# EAGLE board ControllerV6 (EAGLE 9.6.2)
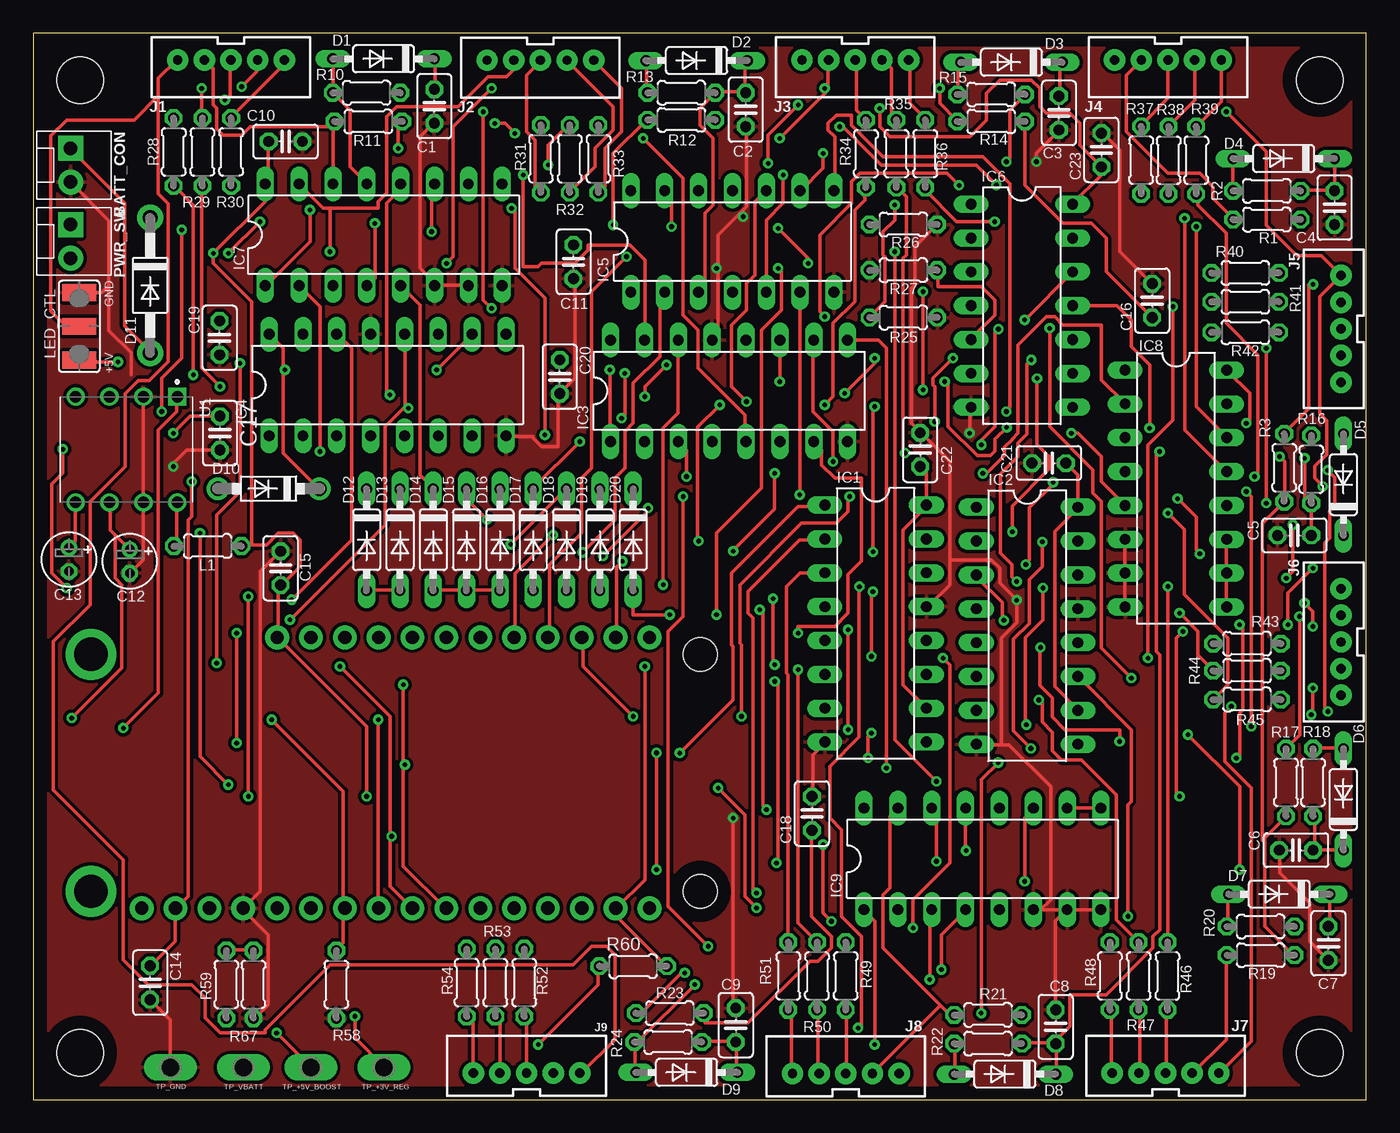
[diagram p5: board, top side]
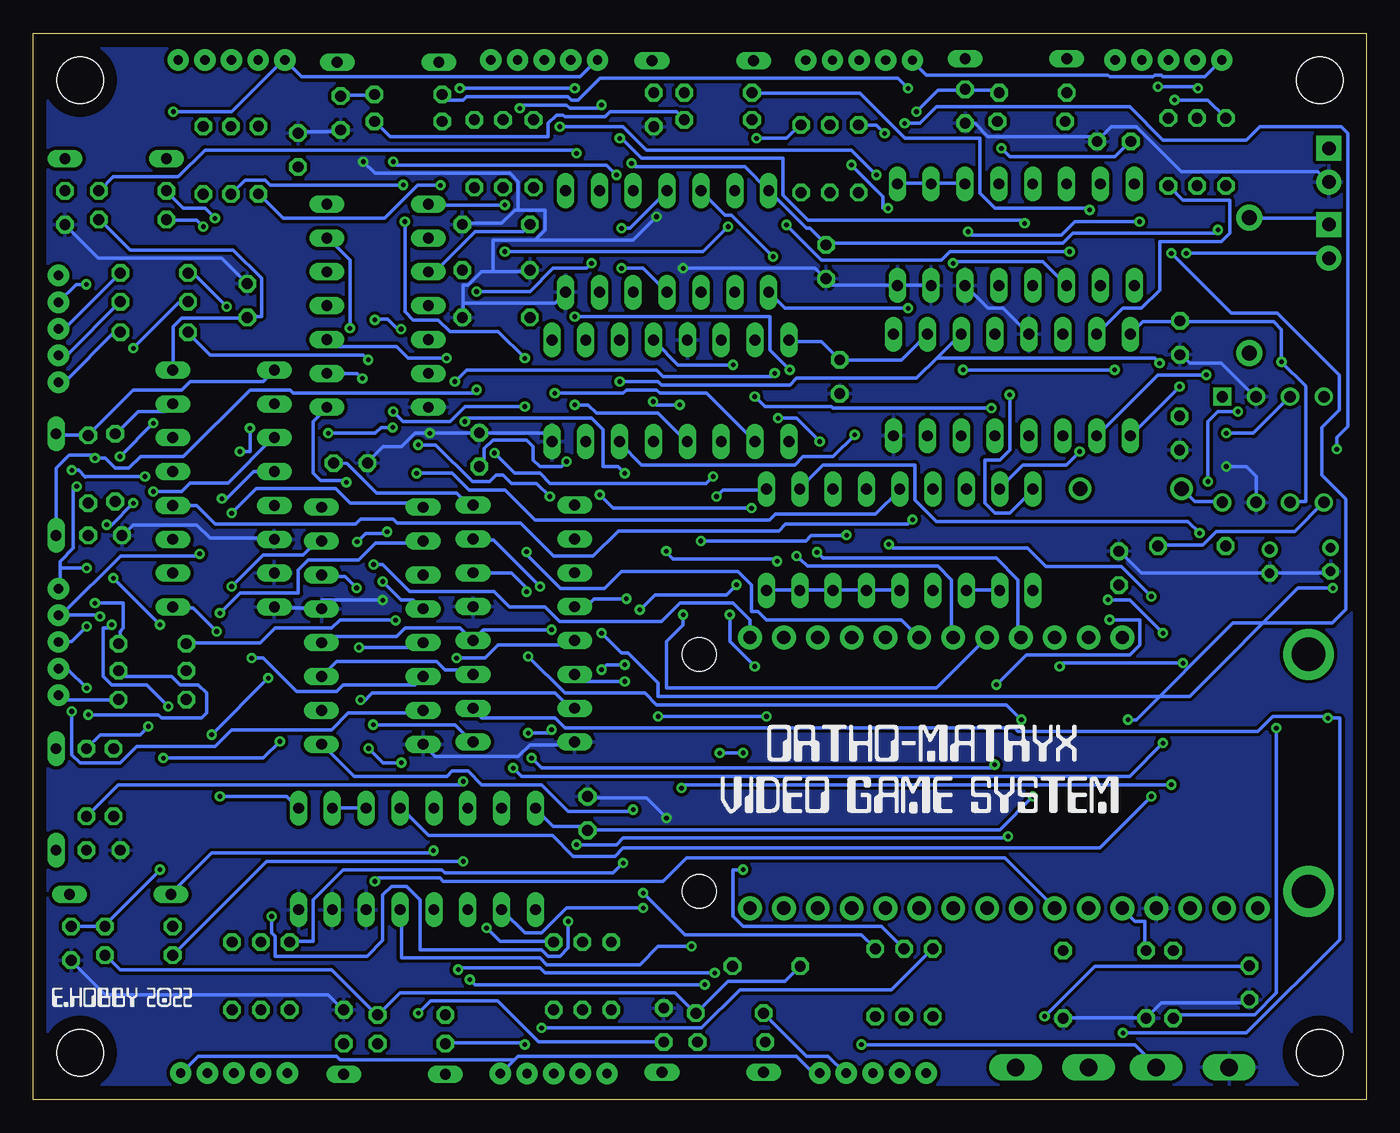
[diagram p6: board, bottom side, seen from below]

Size 100 x 80 mm. Coordinates in mm from the lower left corner, seen from the top.
Outline: 0,0 100,0 100,80 0,80 0,0
Copper layers (1*16): Top 0.035mm / dielectric 1.5mm / Bottom 0.035mm
Design rules "default *": minimum track width 10mil, minimum drill 0.35mm, track to track 10mil, track to pad 10mil, pad to pad 10mil, via to via 10mil, smd to smd 6mil, copper to edge 40mil, drill to drill 6mil, minimum pad ring 10mil, minimum via ring 8mil, stop-mask expansion 4mil, vias tented up to drill 0mil, thermal gap 10mil
Holes 3.5 mm at 3.5,76.5 3.5,3.5 96.5,3.5 96.5,76.5

## Footprints (pad centres in the part's own frame; a part is rotated, then mirrored left to right if it is on the bottom)
MOLEX-1X2 = drill 1.016 pad 1.88 square: 1 0,0 | drill 1.016 pad 1.88: 2 2.54,0
C025-025X050 = drill 0.813 octagon: 1 -1.27,0; 2 1.27,0
E1,8-4 = drill 0.711 pad 1.168: + -0.889,0 | drill 0.711 pad 1.168 octagon: - 0.889,0
DO35-7 = drill 0.813 long: A 3.81,0; C -3.81,0
DO41-7.6 = drill 1.1 pad 1.7: A 3.81,0; C -3.81,0
DO41-10 = drill 1.118 pad 1.93: A 5.08,0; C -5.08,0
DIL16 = drill 0.813 long: 1 -8.89,-3.81; 2 -6.35,-3.81; 3 -3.81,-3.81; 4 -1.27,-3.81; 5 1.27,-3.81; 6 3.81,-3.81; 7 6.35,-3.81; 8 8.89,-3.81; 9 8.89,3.81; 10 6.35,3.81; 11 3.81,3.81; 12 1.27,3.81; 13 -1.27,3.81; 14 -3.81,3.81; 15 -6.35,3.81; 16 -8.89,3.81
DIL14 = drill 0.813 long: 1 -7.62,-3.81; 2 -5.08,-3.81; 3 -2.54,-3.81; 4 0,-3.81; 5 2.54,-3.81; 6 5.08,-3.81; 7 7.62,-3.81; 8 7.62,3.81; 9 5.08,3.81; 10 2.54,3.81; 11 0,3.81; 12 -2.54,3.81; 13 -5.08,3.81; 14 -7.62,3.81
JST-5-PTH-VERT = drill 0.7 pad 1.6: 1 -4,0.18; 2 -2,0.18; 3 0,0.18; 4 2,0.18; 5 4,0.18
0204/5 = drill 0.813 octagon: 1 -2.54,0; 2 2.54,0
SJ_2W = smd 1.27 x 2.54: 1 -2.54,0; 2 0,0; 3 2.54,0
FEATHERWING = drill 1 pad 1.778: 1 6.35,1.27; 2 8.89,1.27; 3 11.43,1.27; 4 13.97,1.27; 5 16.51,1.27; 6 19.05,1.27; 7 21.59,1.27; 8 24.13,1.27; 9 26.67,1.27; 10 29.21,1.27; 11 31.75,1.27; 12 34.29,1.27; 13 36.83,1.27; 14 39.37,1.27; 15 41.91,1.27; 16 44.45,1.27; 17 44.45,21.59; 18 41.91,21.59; 19 39.37,21.59; 20 36.83,21.59; 21 34.29,21.59; 22 31.75,21.59; 23 29.21,21.59; 24 26.67,21.59; 25 24.13,21.59; 26 21.59,21.59; 27 19.05,21.59; 28 16.51,21.59 | drill 2.5 pad 3.81: P$1 2.54,20.32; P$2 2.54,2.54 | hole 2.54: 48.26,20.32; 48.26,2.54
P1-13Y = drill 1.321 pad 1.905 long: TP 0,0
DIP794W47P254L991H457Q8 = drill 0.86 pad 1.21 square: 1 -3.97,3.81 | drill 0.86 pad 1.21: 2 -3.97,1.27; 3 -3.97,-1.27; 4 -3.97,-3.81; 5 3.97,-3.81; 6 3.97,-1.27; 7 3.97,1.27; 8 3.97,3.81

## Placement (x,y rotation side)
BATT_CON  [MOLEX-1X2]  2.79,71.37 270 top
C1  1uF  [C025-025X050]  30.08,74.53 270 top
C2  1uF  [C025-025X050]  53.45,74.27 270 top
C3  1uF  [C025-025X050]  76.95,74.02 270 top
C4  1uF  [C025-025X050]  97.63,66.91 270 top
C5  1uF  [C025-025X050]  94.61,42.33 180 top
C6  1uF  [C025-025X050]  94.74,18.71 180 top
C7  1uF  [C025-025X050]  97.16,11.72 270 top
C8  1uF  [C025-025X050]  76.71,5.46 90 top
C9  1uF  [C025-025X050]  52.7,5.59 90 top
C10  0.1uF  [C025-025X050]  18.92,71.88 0 top
C11  0.1uF  [C025-025X050]  40.53,62.86 270 top
C12  100uF  [E1,8-4]  7.24,40.39 270 top
C13  150uF  [E1,8-4]  2.67,40.51 270 top
C14  0.1uF  [C025-025X050]  8.76,8.76 270 top
C15  0.1uF  [C025-025X050]  18.55,39.87 90 top
C16  0.1uF  [C025-025X050]  83.95,59.94 90 top
C17  0.1uF  [C025-025X050]  14,50 270 top
C18  0.1uF  [C025-025X050]  58.42,21.46 90 top
C19  0.1uF  [C025-025X050]  13.97,57.15 270 top
C20  0.1uF  [C025-025X050]  39.5,54.23 270 top
C21  0.1uF  [C025-025X050]  76.2,47.75 180 top
C22  0.1uF  [C025-025X050]  66.54,48.76 90 top
C23  0.1uF  [C025-025X050]  80.14,71.25 90 top
D1  1N4148  [DO35-7]  26.27,78.08 180 top
D2  1N4148  [DO35-7]  49.77,77.96 180 top
D3  1N4148  [DO35-7]  73.39,77.83 180 top
D4  1N4148  [DO35-7]  93.82,70.6 180 top
D5  1N4148  [DO35-7]  98.3,46.14 90 top
D6  1N4148  [DO35-7]  98.3,22.52 90 top
D7  1N4148  [DO35-7]  93.48,15.4 180 top
D8  1N4148  [DO35-7]  72.9,1.91 180 top
D9  1N4148  [DO35-7]  49.02,2.03 180 top
D10  1N5817  [DO41-7.6]  17.65,45.83 180 top
D11  1N4004  [DO41-10]  8.76,61.09 270 top
D12  1N4148  [DO35-7]  25,42 270 top
D13  1N4148  [DO35-7]  27.5,42 270 top
D14  1N4148  [DO35-7]  30,42 270 top
D15  1N4148  [DO35-7]  32.5,42 270 top
D16  1N4148  [DO35-7]  35,42 270 top
D17  1N4148  [DO35-7]  37.5,42 270 top
D18  1N4148  [DO35-7]  40,42 270 top
D19  1N4148  [DO35-7]  42.5,42 270 top
D20  1N4148  [DO35-7]  45,42 270 top
IC1  74HC595N  [DIL16]  63.2,35.71 270 top
IC2  74HC595N  [DIL16]  74.57,35.55 270 top
IC3  74HC595N  [DIL16]  52.2,53.18 0 top
IC4  74HC595N  [DIL16]  26.57,53.61 0 top
IC5  7414N  [DIL14]  52.45,64.38 0 top
IC6  7414N  [DIL14]  74.17,59.56 270 top
IC7  4053N  [DIL16]  26.29,64.89 0 top
IC8  4053N  [DIL16]  85.72,45.85 270 top
IC9  4053N  [DIL16]  71.22,18.06 0 top
J1  [JST-5-PTH-VERT]  14.83,78.19 180 top
J2  [JST-5-PTH-VERT]  38.04,78.17 180 top
J3  [JST-5-PTH-VERT]  61.67,78.19 180 top
J4  [JST-5-PTH-VERT]  85.13,78.19 180 top
J5  [JST-5-PTH-VERT]  98.3,57.83 90 top
J6  [JST-5-PTH-VERT]  98.3,34.33 90 top
J7  [JST-5-PTH-VERT]  84.95,1.8 0 top
J8  [JST-5-PTH-VERT]  60.96,1.78 0 top
J9  [JST-5-PTH-VERT]  37.01,1.8 0 top
L1  22uH  [0204/5]  13.08,41.53 180 top
LED_CTL  [SJ_2W]  3.45,58.01 90 top
MS2  FEATHERWING  [FEATHERWING]  1.78,13.08 0 top
PWR_SW  [MOLEX-1X2]  2.79,65.66 270 top
R1  10k  [0204/5]  92.55,66.03 180 top
R2  10k  [0204/5]  92.55,68.18 0 top
R3  10k  [0204/5]  93.85,47.41 270 top
R10  10k  [0204/5]  25,75.54 0 top
R11  10k  [0204/5]  25.13,73.38 180 top
R12  10k  [0204/5]  48.62,73.51 0 top
R13  10k  [0204/5]  48.62,75.54 180 top
R14  10k  [0204/5]  71.87,73.38 180 top
R15  10k  [0204/5]  71.87,75.42 0 top
R16  10k  [0204/5]  95.89,47.28 90 top
R17  10k  [0204/5]  93.98,23.79 90 top
R18  10k  [0204/5]  96.01,23.79 270 top
R19  10k  [0204/5]  92.08,10.83 180 top
R20  10k  [0204/5]  92.08,12.99 0 top
R21  10k  [0204/5]  71.63,6.35 0 top
R22  10k  [0204/5]  71.63,4.19 180 top
R23  10k  [0204/5]  47.75,6.48 180 top
R24  10k  [0204/5]  47.62,4.32 0 top
R25  10k  [0204/5]  65.28,58.67 0 top
R26  10k  [0204/5]  65.28,65.66 0 top
R27  10k  [0204/5]  65.28,62.23 180 top
R28  150  [0204/5]  10.53,71.1 270 top
R29  150  [0204/5]  12.68,71.1 270 top
R30  270  [0204/5]  14.84,71.1 270 top
R31  150  [0204/5]  38.08,70.59 270 top
R32  150  [0204/5]  40.24,70.59 270 top
R33  270  [0204/5]  42.4,70.59 270 top
R34  150  [0204/5]  62.47,70.97 270 top
R35  150  [0204/5]  64.75,70.97 270 top
R36  270  [0204/5]  66.91,70.97 270 top
R37  150  [0204/5]  83.12,70.49 270 top
R38  150  [0204/5]  85.18,70.48 270 top
R39  270  [0204/5]  87.25,70.48 270 top
R40  150  [0204/5]  90.93,62.02 180 top
R41  150  [0204/5]  90.93,59.86 180 top
R42  270  [0204/5]  90.93,57.57 180 top
R43  150  [0204/5]  91.06,34.2 180 top
R44  150  [0204/5]  91.06,32.17 180 top
R45  270  [0204/5]  91.06,30.01 180 top
R46  150  [0204/5]  85.09,9.27 90 top
R47  150  [0204/5]  82.93,9.27 90 top
R48  270  [0204/5]  80.77,9.27 90 top
R49  150  [0204/5]  60.96,9.27 90 top
R50  150  [0204/5]  58.8,9.27 90 top
R51  270  [0204/5]  56.64,9.27 90 top
R52  150  [0204/5]  36.83,8.76 90 top
R53  150  [0204/5]  34.67,8.76 90 top
R54  270  [0204/5]  32.51,8.76 90 top
R58  10k  [0204/5]  22.73,8.64 270 top
R59  10k  [0204/5]  14.48,8.64 270 top
R60  10k  [0204/5]  45,10 0 top
R67  10k  [0204/5]  16.51,8.64 270 top
TP_+3V_REG  PTR1PAD1-13Y  [P1-13Y]  26.29,2.41 90 top
TP_+5V_BOOST  PTR1PAD1-13Y  [P1-13Y]  20.83,2.41 90 top
TP_GND  PTR1PAD1-13Y  [P1-13Y]  10.29,2.41 90 top
TP_VBATT  PTR1PAD1-13Y  [P1-13Y]  15.75,2.41 90 top
U1  MAX756CPA  [DIP794W47P254L991H457Q8]  6.99,48.77 270 top

## Tracks (layer width: path | path; a pad name or v marks a point on that pad's centre or on a via)
+3V_REG  (via drill 0.35)
  Top 0.254: C14.1 8.88,10.12 10.62,11.88 10.62,14.25 MS2.2 10.75,14.38 11.62,15.25 11.62,43.5 11.88,43.75 v11.88,46.38 | v24.12,6.25 24.12,4.62 26.25,2.5 TP_+3V_REG.TP | IC6.14 78,67.25 80.12,69.38 80.12,69.88 C23.1 80.12,70 78.5,71.62 78.5,73.25 77.75,74 76,74 75.5,74.5 75.5,75.88 74.88,76.5 72.5,76.5 71.5,75.5 71.5,73.5 70.25,72.25 64.25,72.25 63.51,72.99 63.51,74.37 v63.5,74.38 | v57.38,74.62 55.12,72.38 v55.12,70.25 | v9.62,51.62 9.62,54.12 11.12,55.62 v11.12,65.25
  Bottom 0.254: v24.12,6.25 20.38,10 8.88,10 C14.1 | v63.5,74.38 63.25,74.62 60,74.62 59.75,74.38 57.62,74.38 v57.38,74.62 | v55.12,70.25 54.88,70 46.62,70 44.88,68.25 IC5.14 44.75,68.12 42,65.38 41.75,65.38 40.62,64.25 C11.1 40.5,64.25 22.75,64.25 22,65 11.38,65 v11.12,65.25 | v9.62,51.62 11.12,51.62 11.88,50.88 v11.88,46.38
+5V_BOOST  (via drill 0.35)
  Top 0.254: 18.75,54.75 18.75,56.38 17.75,57.38 IC4.16 | 18.75,54.75 18.75,48.5 21.38,45.88 D10.C | v30.25,54.75 32.88,57.38 IC4.10 | v18.88,54.75 18.75,54.75 | IC2.10 78.38,29.25 76.62,31 76.62,42.62 78.38,44.38 IC2.16 78.38,44.5 78.38,46.88 77.5,47.75 C21.1 | IC1.10 67,29.38 65.25,31.12 65.25,42.75 67,44.5 IC1.16 67,44.62 67,47 66.62,47.38 C22.1 | v60,47.88 60,50.12 58.5,51.62 58.5,56.88 IC3.10 | 6.19,42.31 5.75,42.75 5.75,44.75 U1.6 | 6.19,42.31 7.12,41.38 C12.+ | v18.25,5 20.75,2.5 TP_+5V_BOOST.TP | v2.88,28.62 6.62,32.38 6.62,38.62 6.12,39.12 6.12,42.25 6.19,42.31 | v6.35,55.35 3.58,55.35 LED_CTL.1
  Bottom 0.254: IC3.16 43.25,56.88 40.88,56.88 C20.1 39.38,55.5 34.88,55.5 33,57.38 IC4.10 | IC4.16 17.62,57.5 16.75,58.38 14,58.38 C19.1 13.88,58.38 6.94,58.38 6.35,57.79 v6.35,55.35 4.52,53.52 4.52,44.88 5.62,44.88 U1.6 | v18.88,54.75 v30.25,54.75 | C21.1 76.47,47.73 74.24,45.5 68.25,45.5 67.38,44.62 67.12,44.62 IC1.16 | v18.25,5 9,5 2,12 2,28.62 v2.88,28.62 2.88,28.75 7,28.75 8.12,27.62 26.12,27.62 26.38,27.88 60.12,27.88 60.88,28.62 66.38,28.62 67,29.25 IC1.10 | C22.1 66.16,47.87 66.16,48.83 65.5,49.49 63,49.49 62.5,48.99 62.5,48 62,47.5 60.38,47.5 v60,47.88
D1  (via drill 0.35)
  Top 0.254: D1.C 30.12,78 30.12,75.88 C1.1 | v34.38,59.38 33.75,60 v33.75,74.12
  Bottom 0.254: R10.2 27.75,75.75 30,75.75 C1.1 30.12,75.75 32.12,75.75 v33.75,74.12 | v34.38,59.38 43.62,59.38 44.75,60.5 IC5.1
D2
  Top 0.254: IC5.3 50,60.62 50.38,61 50.38,66.5 51,67.12 51,72.12 50,73.12 50,74.38 51.12,75.5 R13.1 51.25,75.62 53.38,75.62 C2.1 53.38,75.75 53.38,77.75 53.5,77.88 D2.C
D3  (via drill 0.35)
  Top 0.254: v56.25,69.38 56.25,67.25 55,66 55,60.62 IC5.5 | v73,70.38 73.25,70.62 73.25,74.25 74.38,75.38 R15.2 | D3.C 77.12,77.75 77,77.62 77,75.38 C3.1
  Bottom 0.254: v56.25,69.38 57,70.12 72.75,70.12 v73,70.38 | C3.1 76.88,75.38 74.5,75.38 R15.2
D4  (via drill 0.35)
  Top 0.254: D4.C 97.62,70.5 97.62,68.25 C4.1 97.5,68.25 95.12,68.25 R2.2 | v59.25,71 59.25,69.88 57.62,68.25 IC5.9
  Bottom 0.254: v59.25,71 59.5,71.25 87.12,71.25 89.12,69.25 94,69.25 95,68.25 R2.2
D5  (via drill 0.35)
  Top 0.254: C5.1 95.88,42.38 95.88,44.62 R16.1 95.38,45.05 v95.38,48.12 | v55.88,65.38 58.12,63.12 v58.12,62.75 | v66.75,53.25 v66.75,60.62
  Bottom 0.254: v55.88,65.38 55.25,65.38 52.5,68.12 IC5.11 | v58.12,62.75 58.5,62.38 61,62.38 62.75,60.62 v66.75,60.62 | v66.75,53.25 67,53 80.5,53 80.75,53.25 83.75,53.25 88.75,48.25 91.96,48.25 92.83,47.37 93.85,47.37 94.6,48.12 v95.38,48.12 95.62,48.38 97.29,48.38 98.3,47.37 D5.C
D6  (via drill 0.35)
  Top 0.254: D6.C 98.25,18.75 96.12,18.75 C6.1 96.12,18.88 96.12,21.12 R18.2 | v47.88,65.5 47.88,67.62 47.38,68.12 IC5.13 | v64.62,63.62 64.62,27 v67.75,23.88
  Bottom 0.254: v47.88,65.5 49.75,63.62 v64.62,63.62 | v67.75,23.88 68,23.62 93.62,23.62 R18.2
D7  (via drill 0.35)
  Top 0.254: D7.C 97.25,15.38 97.25,13 C7.1 | v76.25,57.88 76.25,50.5 79.5,47.25 79.5,45.5 80.12,44.88 80.12,33.88 v82.38,31.62 | v86.62,27.38 90.5,23.5 v90.5,17.25
  Bottom 0.254: C7.1 97.12,13 R20.2 94.62,13.12 v90.5,17.25 | v76.25,57.88 76.25,63 77.88,64.62 IC6.13 | v86.62,27.38 v82.38,31.62
D8  (via drill 0.35)
  Top 0.254: R22.1 74.25,4.25 76.62,4.25 C8.1 | D8.C 76.75,2 76.75,4.12 C8.1 | v83.75,50.38 83.75,55.12 82.38,56.5 82.38,58.5 81.31,59.56 IC6.11 | v84.5,48.62 84.25,48.38 84.25,33.62 84.5,33.38 84.5,12.75 84,12.25 84,11.38 80.5,7.88 77.75,7.88 77.75,5.5 76.62,4.38 C8.1
  Bottom 0.254: v83.75,50.38 83.75,48.62 v84.5,48.62
D9  (via drill 0.35)
  Top 0.254: R24.2 50.25,4.38 52.62,4.38 C9.1 52.75,4.25 52.75,2.12 D9.C | v75.31,54.1 75.31,49.15 76.2,48.26 76.2,47.29 73.45,44.55 v73.45,42.6 | v75.71,41.84 75.71,40.01 74.72,39.03 74.72,35.74 73.53,34.54 73.53,27.66 v74.84,26.35 | v72.39,25.27 71.12,24 v71.12,6.48
  Bottom 0.254: IC6.9 75.69,54.48 v75.31,54.1 | v75.71,41.84 75.07,42.48 73.57,42.48 v73.45,42.6 | v74.84,26.35 73.77,25.27 v72.39,25.27 | v71.12,6.48 70.21,7.39 65.18,7.39 62.1,4.32 C9.1
GND  (via drill 0.35)
  Top 0.254: IC4.8 35.5,49.75 37.5,49.75 37.5,49.62 38.12,49 39.38,49 39.38,52.88 C20.2 39.5,53 40.62,54.12 40.62,61.5 C11.2 | IC7.7 32.62,61.12 30.12,61.12 IC7.6 30.12,61.25 29,62.38 29,72.25 30,73.25 C1.2 | C14.2 8.88,7.38 10.25,6 10.25,2.5 TP_GND.TP | R67.2 16.62,6.12 17.62,7.12 17.62,12.38 15.75,14.25 MS2.4 15.75,14.38 17,15.62 17,39.62 18.5,41.12 C15.2 | 8.25,44.75 8.25,40.5 C12.- | 7.35,54.38 7.35,56.03 5.67,57.71 5.67,61.09 | 5.67,61.09 5.67,65.95 2.88,68.75 BATT_CON.2 | C7.2 97.12,10.5 95.75,11.88 95.75,14.75 93.5,17 93.5,18.62 C6.2 | C8.2 76.67,6.77 76.67,13.42 77.5,14.25 IC9.7 77.62,14.25 | 77.62,14.25 80,14.25 IC9.8 | v52.5,21.12 52.5,7 52.62,6.88 C9.2 | IC1.8 59.38,26.75 58.5,25.88 58.5,22.75 C18.2 | 72.59,26.62 70.88,26.62 IC2.8 | 72.59,26.62 73.21,26.62 76.33,23.51 76.33,15 75.57,14.25 IC9.6 77.62,14.25 | C16.2 83.88,61.25 81.5,63.62 81.5,71.25 80.25,72.5 C23.2 | IC8.8 81.88,37 81.88,39.38 IC8.7 81.88,39.5 81.88,42 IC8.6 | 51.38,62.38 51.38,64.88 53.06,66.56 | 51.38,62.38 51.38,57.38 51,57 IC3.13 | 53.06,66.56 53.5,67 53.5,73 C2.2 | 68.75,40.5 68.75,47.88 66.62,50 C22.2 66.5,50.12 65.88,50.75 65.88,60.88 66.12,61.12 66.12,64 67.75,65.62 R26.2 | 68.75,40.5 68.75,38.62 67.12,37 IC1.13 | v70.25,50 70.25,51.88 IC6.7 | 53.06,66.56 53.25,66.38 v53.25,66.25 | 68.75,40.5 71.88,40.5 72.5,39.88 72.5,38.75 v73.79,37.47 73.79,35.81 72.62,34.65 72.62,26.66 72.59,26.62 | v75.25,70.38 75.25,71 76.88,72.62 C3.2 | v51.25,62.38 51.38,62.38 | 5.67,61.09 5.14,60.55 LED_CTL.3 | 8.25,44.88 8.25,52.62 U1.2 | C17.2 11.5,48.73 10.5,47.73 v10.5,47.5
  Bottom 0.254: C1.2 30,73.25 29.38,73.25 28.38,72.25 20.5,72.25 20.25,72 C10.2 20.12,72 19.12,73 17.25,73 13.88,69.62 3.62,69.62 2.88,68.88 BATT_CON.2 | IC4.13 25.38,57.5 27.25,59.38 28.38,59.38 30,61 IC7.6 | IC7.7 32.75,61.12 35.12,61.12 IC7.8 35.25,61.12 40.12,61.12 40.5,61.5 C11.2 40.62,61.62 41.38,62.38 v51.25,62.38 | R58.2 22.62,6.12 16.62,6.12 R67.2 16.5,6.12 15.38,7.25 9,7.25 8.88,7.38 C14.2 | C13.- 2.75,39.5 7.12,39.5 C12.- 16.88,39.5 18.5,41.12 C15.2 | 8.38,52.75 10.88,55.25 13.25,55.25 13.88,55.88 C19.2 | C7.2 97.12,10.38 94.62,7.88 77.88,7.88 76.75,6.75 C8.2 | v52.5,21.12 54,22.62 58.38,22.62 C18.2 | IC2.8 70.75,26.62 69.88,25.75 63.62,25.75 62.75,26.62 59.62,26.62 59.5,26.75 IC1.8 | C3.2 77,72.62 80.12,72.62 C23.2 | C4.2 97.62,65.62 95.12,63.12 85.88,63.12 84,61.25 C16.2 | IC8.8 81.88,36.88 78.5,36.88 IC2.13 78.32,37.47 v73.79,37.47 | C5.2 93.25,42.38 92.5,43.12 87.75,43.12 86.75,42.12 82,42.12 IC8.6 | 67.75,59.75 67.75,61.12 67.38,61.12 66.38,62.12 65.5,62.12 | 67.75,59.75 67.75,58.75 R25.2 | 65.5,62.12 62.75,62.12 R27.2 | 67.75,59.75 60.88,59.75 60.12,60.5 IC5.7 | IC3.8 61.12,49.38 61.75,50 66.5,50 C22.2 66.62,50 v70.25,50 71.38,50 72.38,49 73.75,49 74.88,47.88 C21.2 | 65.5,62.12 65.5,64.5 62.38,64.5 | 62.38,64.5 61.62,65.25 61.62,66.75 63.62,66.75 | 63.62,66.75 63.88,66.75 64.88,65.75 67.75,65.75 R26.2 | v53.25,66.25 55,64.5 62.38,64.5 | v75.25,70.38 74.38,69.5 64.25,69.5 63.62,68.88 63.62,66.75 | U1.2 | v10.5,47.5 9,47.5 8.26,46.76 U1.7
  pour Top: 0,80 100,80 100,0 0,0 0,79.5
  pour Bottom: 0,80 100,80 100,0 0,0
INT_MCU  (via drill 0.35)
  Top 0.254: R60.2 47.5,10 43.75,13.75 43.75,14.25 MS2.15 43.75,14.38 45.88,16.5 v45.88,32.5 | D12.A 25,38.25 27.5,38.25 D13.A | D14.A 30,38.25 32.5,38.25 D15.A 32.62,38.25 35,38.25 D16.A | v47.75,36.38 45,36.38 D20.A
  Bottom 0.254: D16.A 35,38.25 37.5,38.25 D17.A 37.62,38.25 40,38.25 D18.A 40.12,38.25 42.5,38.25 D19.A 42.62,38.25 45,38.25 D20.A | D13.A 27.5,38.25 30,38.25 D14.A | v45.88,32.5 47.75,34.38 v47.75,36.38
LED1_B  (via drill 0.35)
  Top 0.254: v14.38,75 14.75,75.38 14.75,78 J1.3
  Bottom 0.254: v14.38,75 11.88,75 10.62,73.75 R28.1
LED1_G  (via drill 0.35)
  Top 0.254: v12.62,75.88 12.62,73.75 R29.1 | v15.62,76 16.75,77.12 16.75,78 J1.2
  Bottom 0.254: v12.62,75.88 12.75,76 v15.62,76
LED1_R
  Top 0.254: R30.1 14.88,73.75 18.75,77.62 18.75,78 J1.1
LED2_B
  Top 0.254: R31.2 38,68.12 37.62,68.5 37.62,72 37,72.62 37,76.88 38,77.88 J2.3
LED2_G
  Top 0.254: R32.2 40.25,68.12 42.12,70 42.12,71.38 43.5,72.75 43.5,74.5 40.12,77.88 J2.2
LED2_R
  Top 0.254: R33.2 42.5,68.12 42.88,68.5 42.88,71.38 44.12,72.62 44.12,75.88 42.12,77.88 J2.1
LED3_B
  Top 0.254: R34.1 62.38,73.62 61.75,74.25 61.75,78 J3.3
LED3_G
  Top 0.254: R35.1 64.75,73.62 64.38,74 64.38,77.38 63.75,78 J3.2
LED3_R
  Top 0.254: R36.1 66.88,73.62 65.75,74.75 65.75,78 J3.1
LED4_B
  Top 0.254: R37.1 83.12,73.12 85.12,75.12 J4.3
LED4_G
  Top 0.254: R38.1 85.25,73.12 87.12,75 J4.2
LED4_R
  Top 0.254: R39.1 87.38,73.12 89.12,74.88 J4.1
LED5_B
  Bottom 0.254: R40.1 97.66,57.83 J5.3
LED5_G
  Bottom 0.254: R41.1 97.5,55.83 J5.2
LED5_R
  Bottom 0.254: R42.1 93.93,57.57 97.62,53.88 98,53.88 J5.1
LED6_B  (via drill 0.35)
  Top 0.254: v95.38,37.25 96,36.62 v96,35.5
  Bottom 0.254: v95.38,37.25 93.25,37.25 93.25,35.38 93.5,35.12 93.5,34.25 R43.1 | v96,35.5 97.12,34.38 98,34.38 J6.3
LED6_G  (via drill 0.35)
  Top 0.254: v95.88,28.88 96,29 v96,30.88
  Bottom 0.254: v95.88,28.88 90.62,28.88 90.38,28.62 87.38,28.62 87,29 87,30.5 87.62,31.12 89,31.12 89.62,31.75 93.12,31.75 93.5,32.12 R44.1 | v96,30.88 97.38,32.25 98,32.25 J6.2
LED6_R
  Bottom 0.254: R45.1 93.62,30 97.75,30 98,30.25 J6.1
LED7_B
  Top 0.254: R46.1 85,6.62 85,2 J7.3
LED7_G
  Top 0.254: R47.1 83,6.62 83,2 J7.2
LED7_R
  Top 0.254: R48.1 80.88,6.62 80.88,2 J7.1
LED8_B
  Top 0.254: R49.1 61,6.62 61,2 J8.3
LED8_G
  Top 0.254: R50.1 58.88,6.62 58.88,2 J8.2
LED8_R
  Top 0.254: R51.1 56.75,6.62 56.88,6.5 56.88,2 J8.1
LED9_B
  Top 0.254: R52.1 36.88,6.12 37,6 37,2 J9.3
LED9_G
  Top 0.254: R53.1 34.75,6.12 35,5.88 35,2 J9.2
LED9_R
  Top 0.254: R54.1 32.62,6.12 33,5.75 33,2 J9.1
LED_CTL  (via drill 0.35)
  Top 0.254: 9.38,75.31 9.38,76.62 10.75,78 J1.5 | v96.75,46.01 96.14,46.61 96.14,47.52 97.03,48.4 97.03,50.93 96.5,51.45 96.5,60.25 98,61.75 J5.5 96.62,63.33 94.8,63.33 92.5,65.62 92.5,71.12 v89.5,74.12 | v89.88,29.5 89.38,29 89.38,25.38 91.38,23.38 91.38,4.38 89,2 J7.5 | v94.12,35.62 94.12,38 v96,39.88 | 9.38,75.31 9.38,67.96 10.12,67.21 10.12,55.38 8.7,53.95 7.87,53.95 6.88,52.95 6.88,47.5 4.25,44.88 4.25,37.12 1.5,34.38 1.5,23.25 6.75,18 6.75,10.5 8.62,8.62 11.88,8.62 12.88,7.62 12.88,6.12 14,5 17.38,5 17.38,5.25 22.25,10.12 40.5,10.12 41.88,11.5 43,11.5 43.62,10.88 43.62,4.5 41.12,2 J9.5 | 9.38,75.31 7.56,73.5 2.5,73.5 1.31,72.31 1.31,59.16 2.45,58.01 LED_CTL.2
  Bottom 0.254: J2.5 34,77.88 33,76.88 19.38,76.88 19.25,76.75 16,76.75 15.88,76.88 15.38,76.88 15.25,76.75 12.12,76.75 10.88,78 J1.5 | 63.94,2.94 63.62,3.25 42.75,3.25 41.5,2 41.12,2 J9.5 | 63.94,2.94 64.88,2 J8.5 | J7.5 88.88,2 87.62,3.25 77.25,3.25 77,3 64,3 63.94,2.94 | J3.5 57.75,78 59,76.75 79.88,76.75 J4.5 81.25,78 85.12,74.12 v89.5,74.12 | 98,39.88 98,40.38 97,41.38 97,46.01 v96.75,46.01 | 98,39.88 98,38.38 J6.5 | v89.88,29.5 91.5,31.12 94.12,31.12 94.75,31.75 94.75,35.38 94.38,35.38 v94.12,35.62 | 98,39.88 v96,39.88
MAX_SHDN  (via drill 0.35)
  Top 0.254: v6.75,27.88 9.38,30.5 9.38,50.25 10.75,51.62 10.75,52.62 U1.1
  Bottom 0.254: v6.75,27.88 6.75,8 8.38,6.38 14.12,6.38 14.38,6.12 R59.2
MUX_SEL  (via drill 0.35)
  Top 0.254: IC9.9 80,21.88 77.62,21.88 IC9.10 | IC8.9 89.5,37 89.5,39.38 IC8.10 89.5,39.5 89.5,42 IC8.11 | v86,22.75 85.75,23 85.75,34.62 v86.25,35.12 | R58.1 22.75,11.25 23.25,11.75 23.25,14.25 MS2.7 23.25,14.38 23.25,23.12 v17.88,28.5 | v29.88,65.12 29.88,68.5 30,68.62 IC7.11 | v14.62,63.5 v17,65.88 | v74.38,16.38 74.38,21.12 75,21.75 IC9.11
  Bottom 0.254: IC9.11 75.12,21.88 77.5,21.88 IC9.10 | v86,22.75 81,22.75 80.12,21.88 IC9.9 | v86.25,35.12 88,36.88 89.5,36.88 IC8.9 | IC7.11 30.12,68.75 32.62,68.75 IC7.10 32.75,68.75 35.12,68.75 IC7.9 | v29.88,65.12 29.62,64.88 22.88,64.88 21.88,65.88 v17,65.88 | v14.62,63.5 10.12,59 6.67,59 2.03,54.37 2.03,51.71 3.33,50.42 3.33,46.86 1.52,45.06 1.52,36.75 2.53,35.75 10,35.75 17.25,28.5 v17.88,28.5 | v74.38,16.38 74.12,16.62 69.5,16.62 69.25,16.38 52.75,16.38 51,18.12 27.12,18.12 23.38,14.38 MS2.7
N$1
  Bottom 0.254: IC4.15 20.12,57.5 18.25,59.38 16.88,59.38 15.5,60.75 15.5,64.38 10.88,64.38 10.25,65 10.25,67.5 13.75,67.5 14.75,68.5 R30.2
N$2  (via drill 0.35)
  Top 0.254: v14,53.5 12.62,54.88 12.62,68.5 R29.2
  Bottom 0.254: v14,53.5 17.62,49.88 IC4.1
N$3
  Top 0.254: BATT_CON.1 2.88,71.25 6.86,67.27 6.86,58.02 8.75,56.12 D11.A
N$4
  Top 0.254: D1.A 22.5,78 22.5,75.62 R10.1 22.5,75.5 23.75,74.25 23.75,70 25,68.75 IC7.13
N$5  (via drill 0.35)
  Top 0.254: v10.5,50 11.77,51.27 C17.1
  Bottom 0.254: U1.3 8.45,50 v10.5,50
N$9  (via drill 0.35)
  Top 0.254: v21.5,48.62 21.5,59.5 20,61 IC7.2
  Bottom 0.254: v21.5,48.62 22.5,47.62 25.75,47.62 27.5,45.88 D13.C
N$10
  Top 0.254: D14.C 30,45.88 29,46.88 29,59.62 27.62,61 IC7.5
N$11  (via drill 0.35)
  Top 0.254: v20.75,66.75 20.75,64.38 17.5,61.12 IC7.1 | D2.A 46,77.88 46,75.62 R13.2
  Bottom 0.254: v20.75,66.75 20.88,66.88 27.88,66.88 29,68 29,72.12 34.62,72.12 38,75.5 46,75.5 R13.2
N$12  (via drill 0.35)
  Top 0.254: IC8.2 81.88,52.25 80.12,54 80.12,58.12 77.25,58.12 76.62,58.75 76,58.75 73.86,56.62 73.86,49.99 73.44,49.56 73.44,49.53 72.87,48.96 72.87,48.33 71.53,46.99 v71.25,46.99
  Bottom 0.254: D16.C 35,45.75 36.81,43.94 44.33,43.94 44.77,43.5 62.38,43.5 64.59,45.72 67.31,45.72 68.58,46.99 v71.25,46.99
N$13  (via drill 0.35)
  Top 0.254: v26.75,52.88 26.5,53.12 26.5,67.25 27.5,68.25 27.5,68.62 IC7.12
  Bottom 0.254: v26.75,52.88 26.75,48.75 27.5,48 28.62,48 28.62,44.75 27.88,44 26.75,44 25,45.75 D12.C
N$14  (via drill 0.35)
  Top 0.254: v31,62.75 31.5,63.25 31.5,73 v34.38,75.88 | D3.A 69.5,77.75 69.38,77.62 69.38,75.5 R15.1
  Bottom 0.254: v31,62.75 30.88,62.88 24.25,62.88 22.5,61.12 IC7.3 | v34.38,75.88 35.12,76.62 57.5,76.62 59.12,75 59.62,75 59.88,75.25 67.5,75.25 67.75,75 68.88,75 69.25,75.38 R15.1
N$15  (via drill 0.35)
  Top 0.254: v41,49.38 37.5,45.88 D17.C | v44.12,51.12 44.38,51.38 v44.38,54.5 | v68.38,53.88 68.62,53.62 68.62,50.5 70.81,48.31 71.81,48.31 72.14,48.65 72.14,49.54 v73.03,50.43 | v77.88,50 78.38,50 80.12,48.25 80.12,46.38 81.88,44.62 IC8.5
  Bottom 0.254: v41,49.38 42.75,51.12 v44.12,51.12 | v44.38,54.5 44.62,54.25 52.75,54.25 53.25,54.75 67.5,54.75 v68.38,53.88 | v73.03,50.43 73.91,50.43 74.34,50 v77.88,50
N$16  (via drill 0.35)
  Top 0.254: v86.38,66.12 86.38,50.25 89.5,47.12 IC8.13 | D4.A 90,70.5 90,68.25 R2.1
  Bottom 0.254: v86.38,66.12 87.12,66.88 88.75,66.88 90,68.12 R2.1
N$17  (via drill 0.35)
  Top 0.254: v74.5,28.12 74.42,28.2 74.42,34.67 75.75,36 v75.75,38.38
  Bottom 0.254: v74.5,28.12 68.38,28.12 67.12,26.88 IC1.9 | v75.75,38.38 76.61,39.25 78.38,39.25 IC2.14
N$18  (via drill 0.35)
  Top 0.254: v47.25,38.62 47.25,50.38 48.38,51.5 48.38,56.88 IC3.14 | v54.5,36.75 54.75,36.5 54.75,22 v55,21.75
  Bottom 0.254: v47.25,38.62 48,37.88 53.38,37.88 v54.5,36.75 | v55,21.75 55.12,21.62 59.88,21.62 61.88,23.62 66.38,23.62 67.39,24.64 68.58,24.64 68.96,24.26 75.94,24.26 75.95,24.27 76.01,24.32 78.34,26.66 IC2.9
N$19
  Bottom 0.254: D5.A 98.25,49.88 96,49.88 R16.2 95.88,49.88 92.5,53.25 88.88,53.25 88.25,53.88 82.75,53.88 82,54.62 IC8.1
N$20  (via drill 0.35)
  Top 0.254: D15.C 32.5,45.05 v34.04,43.51
  Bottom 0.254: v34.04,43.51 34.37,43.18 43.56,43.18 44.07,42.67 56.09,42.67 58,40.77 58.41,40.77 60.96,40.77 63.43,43.24 72.7,43.24 73.02,43.56 75.45,43.56 75.83,43.18 86.36,43.18 87.76,44.58 IC8.12
N$21  (via drill 0.35)
  Top 0.254: R18.1 96.12,26.38 98.25,26.38 D6.A | v91,45.62 91.38,45.25 v91.38,28
  Bottom 0.254: v91,45.62 88.88,45.62 88.25,46.25 85.39,46.25 82.03,49.62 IC8.3 | v91.38,28 92,27.38 95,27.38 96,26.38 R18.1
N$22  (via drill 0.35)
  Top 0.254: v69.98,18.67 69.94,18.7 IC9.13 | R20.1 89.62,13 89.62,15.38 D7.A
  Bottom 0.254: v69.98,18.67 70.15,18.5 86.62,18.5 89.62,15.5 D7.A
N$23  (via drill 0.35)
  Top 0.254: D8.A 69.12,2 69.12,4.12 R22.2 | v63.12,4.12 63.12,13.38 62.38,14.12 IC9.1
  Bottom 0.254: v63.12,4.12 63.25,4.25 69,4.25 R22.2
N$24  (via drill 0.35)
  Top 0.254: D9.A 45.12,2.12 45.12,4.25 R24.1 45.25,4.25 v49.62,8.62 | v67.25,9 67.25,14 67.38,14.12 IC9.3
  Bottom 0.254: v67.25,9 66.88,8.62 v49.62,8.62
N$25  (via drill 0.35)
  Top 0.254: v16.12,37.75 v16.12,22.75 | D18.C 39.97,45.81 v35.81,41.65
  Bottom 0.254: IC9.12 72.41,21.87 70.35,19.81 61.06,19.81 59.5,18.25 56.38,18.25 55.75,18.88 20,18.88 v16.12,22.75 | v16.12,37.75 18.38,40 24.02,40 25.41,41.4 35.56,41.4 v35.81,41.65
N$26  (via drill 0.35)
  Top 0.254: v54.25,14.38 53.38,15.25 53.38,21.38 v51.38,23.38 | v14.62,23.62 12.5,25.75 v12.5,42.5
  Bottom 0.254: v54.25,14.38 60,14.38 61.88,12.5 63.12,12.5 64.75,14.12 IC9.2 | v51.38,23.38 51.12,23.62 v14.62,23.62 | v12.5,42.5 13.38,43.38 32.25,43.38 33.88,45 33.88,47.62 40.75,47.62 42.5,45.88 D19.C
N$27  (via drill 0.35)
  Top 0.254: v50.62,11.5 47.62,14.5 47.62,35.12 48.75,36.25 v48.75,45.25
  Bottom 0.254: v50.62,11.5 53.12,11.5 54.5,10.12 61.5,10.12 62,10.62 72.38,10.62 72.38,14.12 IC9.5 | v48.75,45.25 48.25,45.75 45,45.75 D20.C
N$28  (via drill 0.35)
  Top 0.254: v12,54.38 12,67.12 10.62,68.5 R28.2
  Bottom 0.254: v12,54.38 15.62,54.38 20.12,49.88 IC4.2
N$29  (via drill 0.35)
  Top 0.254: v61.88,5.38 62.12,5.62 62.12,12.25 60.62,13.75 60.62,20.25 59.75,21.12 59.75,25 61.95,27.2 61.95,38.46 v61.98,38.48
  Bottom 0.254: v61.88,5.38 49.88,5.38 47,8.25 35.62,8.25 32.62,11.25 R54.2 | v61.98,38.48 v61.97,38.49 65.48,42 67,42 IC1.15
N$30  (via drill 0.35)
  Top 0.254: v64,24.88 64,56.38 63.39,56.99 IC3.9 | v15.25,35 v15.25,26.75 | v19.38,37.5 23.88,42 23.88,56.38 22.88,57.38 IC4.14
  Bottom 0.254: v64,24.88 63.38,24.25 17.75,24.25 v15.25,26.75 | v15.25,35 17.75,37.5 v19.38,37.5
N$31  (via drill 0.35)
  Top 0.254: v46.75,26 v46.75,17.25 | v48.5,26 52.5,30 52.5,34 52.38,34.12 52.38,39.5 57.38,44.5 59.38,44.5 IC1.1
  Bottom 0.254: v46.75,17.25 47.5,17.25 47.5,13.75 46.75,13 36.38,13 34.75,11.38 R53.2 | v46.75,26 v48.5,26
N$32  (via drill 0.35)
  Top 0.254: v54.25,15.5 54,15.75 54,36.12 53.62,36.5 53.62,38.13 57.49,42 59.38,42 IC1.2
  Bottom 0.254: v54.25,15.5 51.12,12.38 37.88,12.38 36.88,11.38 R52.2
N$33  (via drill 0.35)
  Top 0.254: v45.75,72.12 48.75,69.12 48.75,58.88 49.88,57.75 49.88,54.88 53.38,51.38 53.38,49.38 IC3.5
  Bottom 0.254: v45.75,72.12 43.5,72.12 42.5,73.12 R33.1
N$34  (via drill 0.35)
  Top 0.254: v38.62,70.12 38.62,71.62 40.12,73.12 R32.1 | v35.88,66.88 36.12,66.62 36.12,62.38 38.38,60.12 v38.38,49.88
  Bottom 0.254: v38.62,70.12 36.25,67.75 36.25,66.88 v35.88,66.88 | v38.38,49.88 40,48.25 42.25,48.25 42.88,47.62 54.38,47.62 56,49.25 IC3.6
N$35  (via drill 0.35)
  Top 0.254: v57.38,35 57.38,35.5 60.12,35.5 61.12,36.5 61.12,39.4 62.12,40.4 62.12,46.62 60.12,46.62 59.12,47.62 59.12,48.75 58.62,49.25 IC3.7 | v2.5,38.38 1.37,39.5 1.37,46.18 2.21,47.02 v2.21,48.79 | v34.62,73.25 35.38,73.25 v36.12,72.5
  Bottom 0.254: v57.38,35 55.88,33.5 55.38,33.5 53.12,31.25 53.12,30.25 13.25,30.25 5.12,38.38 v2.5,38.38 | v34.62,73.25 33.5,73.25 32.25,74.5 17.75,74.5 15.25,72 9,72 8,73 1.86,73 1.38,72.51 1.38,50.49 2.21,49.66 v2.21,48.79 | v36.12,72.5 36.75,73.12 38,73.12 R31.1
N$36
  Top 0.254: R59.1 14.5,11.25 16.5,11.25 R67.1
  Bottom 0.254: R67.1 16.62,11.25 16.62,13.38 17.38,13.38 18.25,14.25 MS2.5
N$37
  Top 0.254: R51.2 56.62,11.88 56.62,31.88 56.5,32 56.5,38.5 57.5,39.5 59.37,39.5 IC1.3
N$38  (via drill 0.35)
  Top 0.254: v57.38,32.25 57.38,13.25 58.75,11.88 R50.2 | v55.5,37.57 55.5,32.96 55.62,32.84 v55.62,32.62
  Bottom 0.254: v57.38,32.25 57,32.62 v55.62,32.62 | v55.5,37.57 57.93,37.57 58.25,37.25 58.5,37 58.52,36.98 IC1.4
N$39  (via drill 0.35)
  Top 0.254: v68.25,33.12 68.75,32.62 68.75,17.75 66,15 v66,12.88
  Bottom 0.254: v68.25,33.12 66.12,33.12 65.12,34.12 59.75,34.12 59.5,34.38 IC1.5 | v66,12.88 65,11.88 61,11.88 R49.2
N$40  (via drill 0.35)
  Top 0.254: v59.38,52.12 60,52.75 60,58.25 61.62,59.88 61.62,66.75 62.38,67.5 62.38,68.38 R34.2
  Bottom 0.254: v59.38,52.12 58.38,52.12 57.75,51.5 53.12,51.5 51,49.38 IC3.4
N$41  (via drill 0.35)
  Top 0.254: v60.88,53 63.12,55.25 v63.12,55.62 | R36.2 66.91,68.22 69.25,65.88 v72.12,65.88
  Bottom 0.254: v60.88,53 55.75,53 55.5,53.25 53.25,53.25 53,53 49.5,53 45.88,49.38 IC3.2 | v63.12,55.62 65.12,57.62 68.75,57.62 69.62,58.5 71.5,58.5 72.12,59.12 v72.12,65.88
N$42  (via drill 0.35)
  Top 0.254: v49,46.75 49,48.75 48.5,49.25 IC3.3 | v65.41,48.51 65.25,48.51 65.25,63.12 65.5,63.38 65.5,67.75 64.88,68.38 R35.2
  Bottom 0.254: v49,46.75 49.53,46.22 61.22,46.22 61.99,46.99 62.21,46.99 62.22,47 63.89,47 v65.41,48.51
N$43  (via drill 0.35)
  Top 0.254: v55.62,31.38 55.88,31.12 55.88,17.88 v55.75,17.75
  Bottom 0.254: v55.62,31.38 58.88,31.38 59.38,31.88 IC1.6 | v55.75,17.75 56.5,17 69.12,17 69.38,17.25 76.75,17.25 79,15 79,11.88 80.75,11.88 R48.2
N$44  (via drill 0.35)
  Top 0.254: R47.2 82.88,11.88 81.25,13.5 81.25,22.88 78.62,25.5 77.12,25.5 76.45,26.16 76.45,27.56 75.69,28.32 75.69,29.73 v75.44,29.98
  Bottom 0.254: v75.44,29.98 75.27,29.81 74.58,30.5 60.88,30.5 59.75,29.38 59.5,29.38 IC1.7
N$45  (via drill 0.35)
  Top 0.254: v85.12,38.5 85.12,11.88 R46.2
  Bottom 0.254: v85.12,38.5 82.75,40.88 79.75,40.88 78.75,41.88 78.5,41.88 IC2.15
N$46  (via drill 0.35)
  Top 0.254: v85.12,44 86.36,42.76 86.36,37.89 89.62,34.62 89.62,31.12 88.62,30.12 R45.2
  Bottom 0.254: IC2.1 71.07,44.75 76.24,44.75 77.33,45.84 83.29,45.84 v85.12,44
N$47  (via drill 0.35)
  Top 0.254: v86,36.5 87.38,35.12 87.38,33.38 88.5,32.25 R44.2
  Bottom 0.254: v86,36.5 84.5,38 80.12,38 80.12,39.75 79.38,40.5 75.58,40.5 74.33,41.75 71,41.75 70.88,41.88 IC2.2
N$48  (via drill 0.35)
  Top 0.254: v72.81,35.95 72.69,36.08 72.69,37.29 70.76,39.22 IC2.3
  Bottom 0.254: v72.81,35.95 72.86,36 77,36 77.62,35.38 81.88,35.38 83,34.25 88.5,34.25 R43.2
N$49  (via drill 0.35)
  Top 0.254: v73.78,38.86 73.44,39.21 73.44,40.15 72.56,41.02 72.56,46.94 73.88,48.25 73.88,49.25 74.55,49.93 74.55,55.18 v74.87,55.5
  Bottom 0.254: v73.78,38.86 72.42,37.5 71.5,37.5 70.88,36.88 IC2.4 | v74.87,55.5 75.24,55.88 86.75,55.88 88.38,57.5 R42.2
N$50  (via drill 0.35)
  Top 0.254: v83.62,33.12 83.62,49.12 85.5,51 v85.5,59.5
  Bottom 0.254: v83.62,33.12 82.75,33.12 80.25,30.62 77.25,30.62 76.75,31.12 71.38,31.12 70.88,31.62 IC2.6 | v85.5,59.5 88,62 88.38,62 R40.2
N$51  (via drill 0.35)
  Top 0.254: v97.12,29.12 96.88,29.38 96.88,41.75 97.25,42.12 97.25,44.16 97.66,44.57 97.66,46.67 v97.1,47.22 | v91.62,46.75 91.88,47 91.88,55.88 89.5,58.25 89.5,65 87.38,67.12 87.38,67.88 R39.2
  Bottom 0.254: v97.12,29.12 97.12,25.88 96.5,25.25 93.5,25.25 92.25,26.5 86.38,26.5 85.12,27.75 77.62,27.75 76.38,29 71,29 70.88,29.12 IC2.7 | v97.1,47.22 96.6,47.22 96.1,46.72 96.07,46.75 v91.62,46.75
N$52  (via drill 0.35)
  Top 0.254: v36.75,69.38 36.75,62.5 37.88,62.5 38.12,62.75 40.62,62.75 41.62,63.75 41.62,64.12 44.75,64.12 45.88,63 45.88,57 IC3.15 | v60.5,73 60.75,73 63.62,70.12 70.75,70.12 v72.25,68.62
  Bottom 0.254: v36.75,69.38 38.62,71.25 54,71.25 55.75,73 v60.5,73 | v72.25,68.62 82.25,68.62 82.62,69 84.12,69 85.12,68 R38.2
N$53  (via drill 0.35)
  Top 0.254: v43.25,54.75 43.25,49.38 IC3.1 | v59.38,58.75 59,59.12 59,64.88 61.38,67.25 61.38,68.88 62,69.5 68.5,69.5 68.55,69.5 v69.45,68.59
  Bottom 0.254: v43.25,54.75 44.75,56.25 44.75,58.75 v59.38,58.75 | v69.45,68.59 71.17,68.59 73.64,66.12 81.25,66.12 83,67.88 R37.2
N$64  (via drill 0.35)
  Top 0.254: v81.5,26.88 81.5,27.75 77.41,27.75 76.45,28.7 76.45,30.14 75.53,31.07 75.53,33.88 v75.56,33.91 | v90.25,25.62 90.5,25.88 90.5,29 90.75,29.25 90.75,35.38 v90.5,35.62 | v94,39.12 94.5,39.62 v94.5,43.12 | v92.5,56.38 v92.5,44.75
  Bottom 0.254: v75.56,33.91 71.21,33.91 70.88,34.25 IC2.5 | v81.5,26.88 82.75,25.62 v90.25,25.62 | v94,39.12 v90.5,35.62 | v94.5,43.12 94.12,43.12 v92.5,44.75 | v92.5,56.38 89.12,59.75 88.5,59.75 R41.2
N$78  (via drill 0.35)
  Top 0.254: v64.62,67.12 64.62,66 63.75,65.12 63.75,63.38 63.88,63.25 63.88,59.88 62.75,58.75 R25.1
  Bottom 0.254: v64.62,67.12 70.25,67.12 IC6.1
N$79
  Bottom 0.254: R26.1 62.75,65.62 63.25,65.12 66.88,65.12 69.88,62.12 70.25,62.12 IC6.3
N$80
  Top 0.254: IC6.5 70.38,57.12 72.12,58.88 72.12,60 71.12,61 67.88,61 67.88,62.12 R27.1
N$83
  Top 0.254: L1.2 10.62,41.62 10.75,41.75 10.75,44.75 U1.8
  Bottom 0.254: D10.A 13.75,45.75 12.88,44.88 10.88,44.88 U1.8
SHFT_CLK  (via drill 0.35)
  Top 0.254: v56,53.88 56,56.88 IC3.11 | 26.75,19.75 26.75,28.75 v23,32.5 | 26.75,19.75 26.75,16 28.38,14.38 MS2.9 | v13.75,32.75 13.75,43.88 15.5,45.62 v15.5,55.25 | v82.12,13.75 82.12,22.12 82.38,22.38 82.38,27.75 78.5,31.62 IC2.11 | v59.88,13.38 59.25,14 v59.25,19.12 | v26.88,19.75 26.75,19.75
  Bottom 0.254: IC1.11 67.12,32 67.38,32.25 69.12,32.25 69.75,32.88 77.25,32.88 IC2.11 | 32.19,55.69 33.75,54.12 42.75,54.12 43.25,53.62 52.88,53.62 53.12,53.88 v56,53.88 | 32.19,55.69 30.5,57.38 IC4.11 | v23,32.5 22.75,32.75 v13.75,32.75 | v15.5,55.25 15.88,55.62 32.12,55.62 32.19,55.69 | v82.12,13.75 82.12,12.5 81.88,12.25 81.88,10.75 74.97,10.75 73.78,11.94 73.78,15.34 73.12,16 72,16 71,15 71,11.25 61.88,11.25 61.38,10.75 60.5,10.75 59.88,11.38 v59.88,13.38 | v59.25,19.12 56.25,19.12 55.75,19.62 27,19.62 v26.88,19.75
SHFT_LAT  (via drill 0.35)
  Top 0.254: v47.5,55.12 45.88,53.5 v45.88,52.75 | IC4.12 27.88,57.38 27.88,52.12 v28.12,51.88 27.88,52 26.38,50.5 26.38,43.12 v19.25,36 | v27.75,31.12 27.75,25.12 | 27.75,25.12 27.75,17.5 30.88,14.38 MS2.10 | v61.12,27.75 v61.12,35.25 | v62.88,27.5 62.62,27.25 v62.62,25.62 | v27.88,25.12 27.75,25.12
  Bottom 0.254: IC2.12 78.38,34.38 78,34.75 72.75,34.75 72.12,35.38 68,35.38 67.12,34.5 IC1.12 67,34.5 66.25,35.25 v61.12,35.25 | v47.5,55.12 51.62,55.12 53.38,56.88 IC3.12 | v45.88,52.75 45.12,52 40.12,52 40,51.88 v28.12,51.88 | v27.75,31.12 25.5,33.38 17.75,33.38 17,34.12 17,36 v19.25,36 | v61.12,27.75 61.38,27.5 v62.88,27.5 | v62.62,25.62 61.88,24.88 28.12,24.88 v27.88,25.12
SHFT_SER  (via drill 0.35)
  Top 0.254: v62.99,38.1 62.88,37.98 v62.88,33.25 | v25.88,28.5 25.88,14.38 MS2.8
  Bottom 0.254: v62.99,38.1 62.99,38.37 64.12,39.5 67,39.5 IC1.14 | v62.88,33.25 60.12,30.5 54.12,30.5 53.25,29.62 27,29.62 v25.88,28.5
SW1
  Top 0.254: IC7.14 22.5,68.75 22.5,73.38 R11.2 22.38,73 16.25,73 15.62,72.37 14.23,72.37 13.75,72.86 13.75,74.39 13.5,74.64 13.5,77.38 12.88,78 J1.4
SW1_MCU  (via drill 0.35)
  Top 0.254: v41.21,41.06 43.62,43.48 43.62,46.62 44.38,47.38 44.38,50.12 45,50.75 45,53.75 47,55.75 47,60.25 47.25,60.5 IC5.2
  Bottom 0.254: v41.21,41.06 40.77,40.62 27.75,40.62 26.12,39 26.12,34.75 26,34.75 MS2.25
SW2  (via drill 0.35)
  Top 0.254: 22.25,66.88 25.88,66.88 25.88,67.38 26.5,68 26.5,73.75 27.25,74.5 31.88,74.5 34.12,76.75 35.5,76.75 36,77.25 36,77.88 J2.4 | 22.25,66.88 21.75,66.88 20,68.62 IC7.15 | v43.5,65.62 43.5,71 46,73.5 R12.1 | 22.25,66.88 v22.25,63.62
  Bottom 0.254: v43.5,65.62 40.88,63 31.88,63 31.25,63.62 v22.25,63.62
SW2_MCU  (via drill 0.35)
  Top 0.254: v55.88,62.38 56.12,62.12 56.12,59.25 54.62,57.75 54.62,45.88 51.25,42.5 v51.25,36.38
  Bottom 0.254: v55.88,62.38 54.25,62.38 52.5,60.62 IC5.4 | v51.25,36.38 51.25,35.62 52.5,34.38 52.5,30.88 32.25,30.88 28.5,34.62 MS2.24
SW3  (via drill 0.35)
  Top 0.254: v25.62,65.75 25.62,61.62 25.12,61.12 IC7.4 | v56,72.12 59.62,75.75 59.62,75.88 | 59.62,75.88 59.62,78 J3.4 | v68,75.88 68,74.75 69.25,73.5 R14.2 | v59.38,75.88 59.62,75.88
  Bottom 0.254: v25.62,65.75 25.88,66 41.88,66 43.75,67.88 43.75,70.62 54.38,70.62 55.88,72.12 v56,72.12 | v59.38,75.88 v68,75.88
SW3_MCU  (via drill 0.35)
  Top 0.254: v57.5,45.38 57.5,60.5 IC5.6 | v46.12,44.38 46.12,44.17 v42.74,40.78
  Bottom 0.254: v57.5,45.38 56.5,44.38 v46.12,44.38 | v42.74,40.78 42.48,40.53 42.44,40.53 41.93,40.02 32.14,40.02 31.12,39 31.12,34.75 31,34.75 MS2.23
SW4  (via drill 0.35)
  Top 0.254: v87.25,65.5 87.25,52 89.5,49.75 IC8.14 | J4.4 82,76.88 82,72.62 85.12,69.5 87.5,69.5 88.5,68.5 88.5,67.62 90,66.12 R1.2
  Bottom 0.254: v87.25,65.5 87.75,66 90,66 R1.2
SW4_MCU  (via drill 0.35)
  Top 0.254: v73,51.62 73.28,51.9 73.28,68.72 71.25,70.75 71.12,70.75 63.75,70.75 61.38,73.12 61.38,73.88 60.25,73.88 59.62,73.25 59.62,72.75 60.12,72.25 60.12,68.25 IC5.8 | v63.12,52 63,51.88 v63,41.09
  Bottom 0.254: v73,51.62 72.25,50.88 68.75,50.88 67.62,52 v63.12,52 | MS2.22 33.62,34.75 34.88,36 45,36 45.62,36.62 46.12,36.62 46.12,38.62 47.12,39.62 55.88,39.62 57.15,38.35 60.45,38.35 63,40.9 v63,41.09
SW5  (via drill 0.35)
  Top 0.254: v96.02,61.16 95.7,61.16 95.7,51.84 93.85,50 R3.1
  Bottom 0.254: IC8.15 89.62,52.12 90.12,51.62 92.12,51.62 93.75,50 R3.1 | v96.02,61.16 96.78,61.16 J5.4
SW5_MCU  (via drill 0.35)
  Top 0.254: v53.5,52.38 52.38,53.5 52.38,58.12 53.5,59.25 53.5,61.25 54.12,61.88 54.12,67.38 54.88,68.12 IC5.10 | v51.5,52.12 49.82,50.45 49.82,42 v49.91,41.91 | v38.98,42.34 36.12,39.48 36.12,34.75 MS2.21
  Bottom 0.254: v53.5,52.38 53.25,52.12 v51.5,52.12 | v49.91,41.91 v49.9,41.92 42.05,41.92 41.66,42.31 39.02,42.31 v38.98,42.34
SW6  (via drill 0.35)
  Top 0.254: v95,36.25 95,27.38 94,26.38 R17.2 | v85.85,45.08 87.25,43.69 87.25,41.22 v87.52,40.94
  Bottom 0.254: v95,36.25 95.12,36.38 98,36.38 J6.4 97.75,36.5 93.46,40.79 87.67,40.79 v87.52,40.94 | v85.85,45.08 85.5,45.08 83.46,47.12 IC8.4
SW6_MCU  (via drill 0.35)
  Top 0.254: v44.5,63.25 41.88,60.62 41.88,47.38 41.12,46.62 41.12,42.52 38.73,40.13 38.73,35.25 MS2.20
  Bottom 0.254: v44.5,63.25 47.62,66.38 48.12,66.38 49.88,68.12 IC5.12
SW7  (via drill 0.35)
  Top 0.254: v67.75,17.88 67.75,21.5 67.5,21.75 IC9.14 | J7.4 87,2 89.5,4.5 89.5,10.75 R19.2
  Bottom 0.254: v67.75,17.88 82.5,17.88 89.5,10.88 R19.2
SW7_MCU  (via drill 0.35)
  Top 0.254: v74.38,58.5 IC6.12 | v72.41,57.81 72.12,57.53 72.12,50.5 71.12,49.5 v71.12,49.12 | v61.25,45.25 61.12,45.12 61.12,44.12 60.25,43.25 57.63,43.25 53,38.62 53,34.25 53.12,34.12 v53.12,28.75 | v45,28.75 41.25,32.5 41.25,34.62 MS2.19
  Bottom 0.254: v74.38,58.5 74.4,58.5 74.48,58.57 73.42,58.57 72.65,57.81 v72.41,57.81 | v71.12,49.12 69.83,49.12 67.06,46.35 65.79,46.35 65.28,46.86 64.77,46.86 64.14,46.23 62.23,46.23 v61.25,45.25 | v45,28.75 v53.12,28.75
SW8
  Top 0.254: 68.06,7.06 68.75,6.38 69,6.38 R21.1 | 68.06,7.06 63.75,11.38 63.75,15.38 64.25,15.88 64.25,21.25 64.75,21.75 IC9.15 | 68.06,7.06 63,2 J8.4
SW8_MCU  (via drill 0.35)
  Top 0.254: v69,55.62 67.5,54.12 67.5,53.62 67.62,53.5 v67.62,50.88 | v52.52,41.14 52.52,41.22 55.62,44.33 v55.62,46.99 | v44.2,40.39 43.75,39.94 43.75,34.75 MS2.18
  Bottom 0.254: v69,55.62 71.88,55.62 72.75,56.5 77.38,56.5 77.88,57 IC6.10 | v67.62,50.88 67.38,51.12 58.12,51.12 57.27,50.27 57.27,47.49 56.12,47.49 v55.62,46.99 | v52.52,41.14 52.55,41.11 52,40.56 44.2,40.56 v44.2,40.39
SW9  (via drill 0.35)
  Top 0.254: v68.12,9.75 68.12,12.38 69.88,14.12 IC9.4 | v48.88,9.5 48.62,9.5 45.62,6.5 45.25,6.5 R23.2
  Bottom 0.254: R23.2 45.12,6.38 42,3.25 40.38,3.25 39.12,2 J9.4 | v68.12,9.75 68,9.88 62,9.88 61.62,9.5 v48.88,9.5
SW9_MCU  (via drill 0.35)
  Top 0.254: v74.47,40.15 74.47,40.24 74.73,40.5 74.73,44.41 76.51,46.19 v76.51,46.31
  Bottom 0.254: v76.51,46.31 76.65,46.45 78.45,46.45 79,47 79,50.88 78,51.88 IC6.8 | MS2.17 46.25,34.75 46.25,36 47.5,37.25 51.5,37.25 52.88,35.88 60.51,35.88 61.59,36.96 64.26,36.96 65.43,38.12 71.78,38.12 73.8,40.15 v74.47,40.15
SW_BATT
  Bottom 0.254: PWR_SW.1 2.88,65.75 3.25,66.12 8.75,66.12 D11.C
VBAT  (via drill 0.35)
  Top 0.254: C13.+ 2.75,41.5 3.12,41.88 3.12,44.75 U1.5 | 16.38,41.62 17.5,41.62 18.38,42.5 19.5,42.5 20,42 20,40 18.62,38.62 C15.1 18.5,38.5 18.38,38.38 18.38,34.75 MS2.28 18.38,34.62 25,28 v25,22.75 | 16.38,41.62 15.62,41.62 L1.1 | C10.1 17.62,71.88 17.62,68.88 17.5,68.75 IC7.16 17.38,68.62 17.38,67.38 v13.5,63.5 13.5,62.75 16.38,59.88 16.38,41.62 | v27.38,71.38 27.38,73.12 27.62,73.38 R11.1 | R14.1 74.38,73.38 74.38,68.62 77.25,65.75 79.38,65.75 80.5,64.62 80.5,62.12 83.88,58.75 C16.1 | 92.38,19.62 92.2,19.45 92.2,43.2 93.75,44.75 R3.2 93.88,45 93.88,47.88 v93.5,48.25 | 92.38,19.62 93.88,21.12 R17.1 | 92.38,19.62 92.38,13 94.5,10.88 R19.1 | v37.88,4.12 42.38,8.62 42.38,10 R60.1 | C18.1 58.38,20.12 58.38,13.75 59.88,12.25 59.88,11.38 58.88,10.38 58.25,10.38 53.62,5.75 50.38,5.75 50.38,6.38 R23.1 | v91,50.75 91.25,51 91.25,53 89.62,54.62 IC8.16
  Bottom 0.254: U1.5 3.25,44.75 5.38,42.62 11.25,42.62 12.25,41.62 15.5,41.62 L1.1 | v27.38,71.38 26.75,70.75 18.88,70.75 17.75,71.88 C10.1 | v13.5,63.5 3.25,63.5 2.88,63.12 PWR_SW.2 | IC8.16 89.5,54.75 89.5,58 88.88,58.62 84,58.62 C16.1 83.88,58.75 82.88,58.75 82.88,61.62 85,63.75 92.75,63.75 95,66 R1.1 | R12.2 51.25,73.62 51.75,74.12 56.75,74.12 57.12,73.75 60.12,73.75 60.25,73.88 60.75,73.88 61.38,73.25 61.38,72.25 73.25,72.25 74.38,73.38 R14.1 | R19.1 94.5,10.75 93.5,9.75 77.62,9.75 74.25,6.38 R21.2 74.12,6.38 72.5,8 51.88,8 50.38,6.5 R23.1 50.25,6.5 47.88,8.88 43.62,8.88 42.5,10 R60.1 | IC9.16 62.25,21.75 61,20.5 58.75,20.5 58.5,20.25 C18.1 58.38,20.25 27.5,20.25 v25,22.75 | v37.88,4.12 17.38,4.12 15.75,2.5 TP_VBATT.TP | v93.5,48.25 v91,50.75

## Text on the board
tPlace: GND | +5V